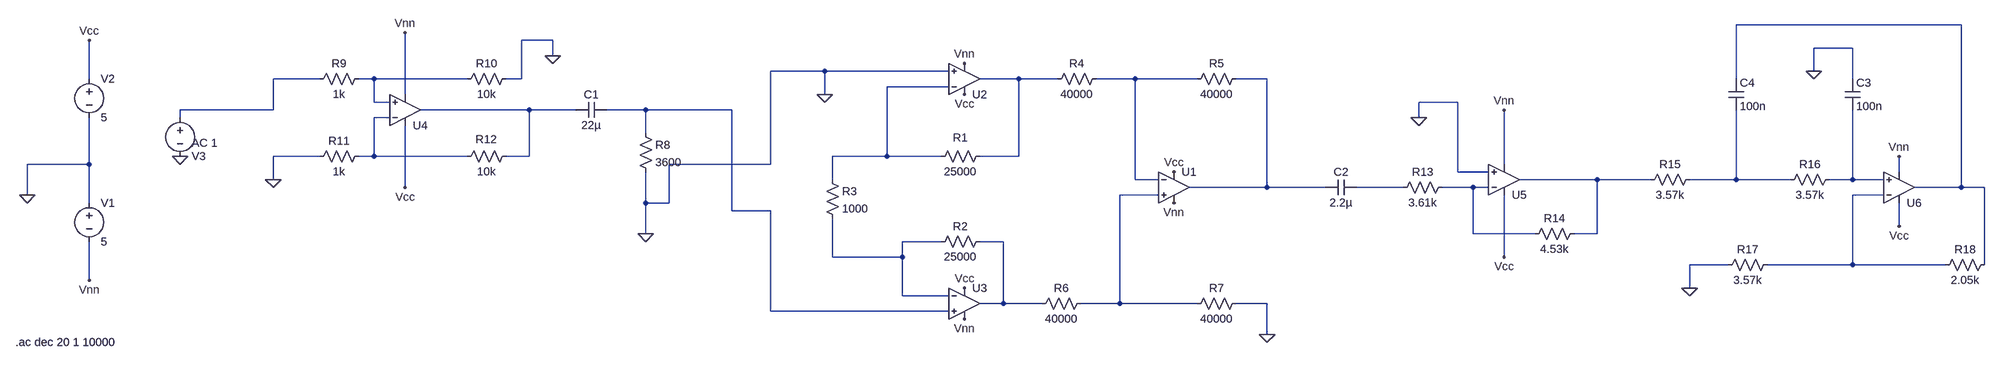
[diagram p0: schematic SimulationCircuit.asc]
SimulationCircuit.asc, the LTspice schematic file:
Version 4
SHEET 1 3172 680
WIRE 3040 -64 2576 -64
WIRE -144 -32 -208 -32
WIRE 2816 -16 2736 -16
WIRE -144 0 -144 -32
WIRE 432 32 320 32
WIRE 688 32 432 32
WIRE 2736 32 2736 -16
WIRE -1136 48 -1136 -32
WIRE -624 48 -720 48
WIRE -512 48 -544 48
WIRE -320 48 -512 48
WIRE -208 48 -208 -32
WIRE -208 48 -240 48
WIRE 832 48 752 48
WIRE 912 48 832 48
WIRE 1072 48 992 48
WIRE 1200 48 1072 48
WIRE 1344 48 1280 48
WIRE 2576 48 2576 -64
WIRE 2816 48 2816 -16
WIRE 688 64 560 64
WIRE -448 80 -448 -48
WIRE 432 80 432 32
WIRE -512 96 -512 48
WIRE -480 96 -512 96
WIRE 1840 96 1760 96
WIRE -720 112 -720 48
WIRE -720 112 -912 112
WIRE -192 112 -416 112
WIRE -96 112 -192 112
WIRE 48 112 -32 112
WIRE 240 112 48 112
WIRE -912 128 -912 112
WIRE -480 128 -512 128
WIRE 1760 128 1760 96
WIRE 48 160 48 112
WIRE -624 208 -720 208
WIRE -512 208 -512 128
WIRE -512 208 -544 208
WIRE -320 208 -512 208
WIRE -192 208 -192 112
WIRE -192 208 -240 208
WIRE 560 208 560 64
WIRE 560 208 448 208
WIRE 672 208 560 208
WIRE 832 208 832 48
WIRE 832 208 752 208
WIRE -1136 224 -1136 128
WIRE -1136 224 -1264 224
WIRE 320 224 320 32
WIRE 320 224 96 224
WIRE 1936 224 1936 112
WIRE 1840 240 1840 96
WIRE 1904 240 1840 240
WIRE 2912 240 2912 208
WIRE -720 256 -720 208
WIRE 448 256 448 208
WIRE 1072 256 1072 48
WIRE 1120 256 1072 256
WIRE 2128 256 1968 256
WIRE 2400 256 2128 256
WIRE 2576 256 2576 112
WIRE 2576 256 2480 256
WIRE 2688 256 2576 256
WIRE 2816 256 2816 112
WIRE 2816 256 2768 256
WIRE 2880 256 2816 256
WIRE -448 272 -448 144
WIRE 1344 272 1344 48
WIRE 1344 272 1184 272
WIRE 1568 272 1344 272
WIRE 1728 272 1632 272
WIRE 1872 272 1808 272
WIRE 1904 272 1872 272
WIRE 3040 272 3040 -64
WIRE 3040 272 2944 272
WIRE 3088 272 3040 272
WIRE -1264 288 -1264 224
WIRE 1120 288 1040 288
WIRE 2880 288 2816 288
WIRE -1136 304 -1136 224
WIRE 48 304 48 240
WIRE 96 304 96 224
WIRE 96 304 48 304
WIRE 240 320 240 112
WIRE 320 320 240 320
WIRE 2912 352 2912 304
WIRE 48 368 48 304
WIRE 1872 368 1872 272
WIRE 2000 368 1872 368
WIRE 2128 368 2128 256
WIRE 2128 368 2080 368
WIRE 672 384 592 384
WIRE 800 384 752 384
WIRE 448 416 448 336
WIRE 592 416 592 384
WIRE 592 416 448 416
WIRE 1936 416 1936 288
WIRE 2560 432 2480 432
WIRE 2816 432 2816 288
WIRE 2816 432 2640 432
WIRE 3008 432 2816 432
WIRE 3088 432 3088 272
WIRE -1136 464 -1136 384
WIRE 2480 480 2480 432
WIRE 592 496 592 416
WIRE 688 496 592 496
WIRE 800 512 800 384
WIRE 800 512 752 512
WIRE 880 512 800 512
WIRE 1040 512 1040 288
WIRE 1040 512 960 512
WIRE 1200 512 1040 512
WIRE 1344 512 1280 512
WIRE 320 528 320 320
WIRE 688 528 320 528
WIRE 1344 576 1344 512
FLAG -1264 288 0
FLAG -1136 -32 Vcc
FLAG -1136 464 Vnn
FLAG 1344 576 0
FLAG 720 480 Vcc
FLAG 1152 240 Vcc
FLAG 720 80 Vcc
FLAG 720 16 Vnn
FLAG 720 544 Vnn
FLAG 1152 304 Vnn
FLAG 432 80 0
FLAG 48 368 0
FLAG -912 208 0
FLAG -720 256 0
FLAG -144 0 0
FLAG -448 -48 Vnn
FLAG -448 272 Vcc
FLAG 1760 128 0
FLAG 1936 112 Vnn
FLAG 1936 416 Vcc
FLAG 2736 32 0
FLAG 2480 480 0
FLAG 2912 208 Vnn
FLAG 2912 352 Vcc
SYMBOL voltage -1136 288 R0
WINDOW 123 0 0 Left 0
WINDOW 39 0 0 Left 0
SYMATTR InstName V1
SYMATTR Value 5
SYMBOL voltage -1136 32 R0
WINDOW 123 0 0 Left 0
WINDOW 39 0 0 Left 0
SYMATTR InstName V2
SYMATTR Value 5
SYMBOL res 768 192 R90
WINDOW 0 -7 56 VBottom 2
WINDOW 3 32 56 VTop 2
SYMATTR InstName R1
SYMATTR Value 25000
SYMBOL res 768 368 R90
WINDOW 0 0 56 VBottom 2
WINDOW 3 32 56 VTop 2
SYMATTR InstName R2
SYMATTR Value 25000
SYMBOL res 432 240 R0
SYMATTR InstName R3
SYMATTR Value 1000
SYMBOL res 1008 32 R90
WINDOW 0 0 56 VBottom 2
WINDOW 3 32 56 VTop 2
SYMATTR InstName R4
SYMATTR Value 40000
SYMBOL res 1296 32 R90
WINDOW 0 0 56 VBottom 2
WINDOW 3 32 56 VTop 2
SYMATTR InstName R5
SYMATTR Value 40000
SYMBOL res 976 496 R90
WINDOW 0 0 56 VBottom 2
WINDOW 3 32 56 VTop 2
SYMATTR InstName R6
SYMATTR Value 40000
SYMBOL res 1296 496 R90
WINDOW 0 0 56 VBottom 2
WINDOW 3 32 56 VTop 2
SYMATTR InstName R7
SYMATTR Value 40000
SYMBOL Opamps\\UniversalOpamp2 1152 272 R0
SYMATTR InstName U1
SYMBOL Opamps\\UniversalOpamp2 720 48 M180
SYMATTR InstName U2
SYMBOL Opamps\\UniversalOpamp2 720 512 R0
SYMATTR InstName U3
SYMBOL voltage -912 112 R0
WINDOW 0 24 96 Left 2
WINDOW 3 24 16 Left 2
WINDOW 123 24 68 Left 2
WINDOW 39 0 0 Left 0
SYMATTR InstName V3
SYMATTR Value ""
SYMATTR Value2 AC 1
SYMBOL res 32 144 R0
SYMATTR InstName R8
SYMATTR Value 3600
SYMBOL cap -32 96 R90
WINDOW 0 0 32 VBottom 2
WINDOW 3 32 32 VTop 2
SYMATTR InstName C1
SYMATTR Value 22µ
SYMBOL Opamps\\UniversalOpamp2 -448 112 M180
SYMATTR InstName U4
SYMBOL res -528 32 R90
WINDOW 0 0 56 VBottom 2
WINDOW 3 32 56 VTop 2
SYMATTR InstName R9
SYMATTR Value 1k
SYMBOL res -224 32 R90
WINDOW 0 0 56 VBottom 2
WINDOW 3 32 56 VTop 2
SYMATTR InstName R10
SYMATTR Value 10k
SYMBOL res -528 192 R90
WINDOW 0 0 56 VBottom 2
WINDOW 3 32 56 VTop 2
SYMATTR InstName R11
SYMATTR Value 1k
SYMBOL res -224 192 R90
WINDOW 0 -4 57 VBottom 2
WINDOW 3 32 56 VTop 2
SYMATTR InstName R12
SYMATTR Value 10k
SYMBOL cap 1632 256 R90
WINDOW 0 0 32 VBottom 2
WINDOW 3 32 32 VTop 2
SYMATTR InstName C2
SYMATTR Value 2.2µ
SYMBOL res 1824 256 R90
WINDOW 0 0 56 VBottom 2
WINDOW 3 32 56 VTop 2
SYMATTR InstName R13
SYMATTR Value 3.61k
SYMBOL res 2096 352 R90
WINDOW 0 0 56 VBottom 2
WINDOW 3 32 56 VTop 2
SYMATTR InstName R14
SYMATTR Value 4.53k
SYMBOL Opamps\\UniversalOpamp2 1936 256 M180
SYMATTR InstName U5
SYMBOL res 2496 240 R90
WINDOW 0 0 56 VBottom 2
WINDOW 3 32 56 VTop 2
SYMATTR InstName R15
SYMATTR Value 3.57k
SYMBOL res 2784 240 R90
WINDOW 0 0 56 VBottom 2
WINDOW 3 32 56 VTop 2
SYMATTR InstName R16
SYMATTR Value 3.57k
SYMBOL res 2656 416 R90
WINDOW 0 0 56 VBottom 2
WINDOW 3 32 56 VTop 2
SYMATTR InstName R17
SYMATTR Value 3.57k
SYMBOL Opamps\\UniversalOpamp2 2912 272 M180
SYMATTR InstName U6
SYMBOL cap 2800 48 R0
SYMATTR InstName C3
SYMATTR Value 100n
SYMBOL cap 2560 48 R0
SYMATTR InstName C4
SYMATTR Value 100n
SYMBOL res 3104 416 R90
WINDOW 0 0 56 VBottom 2
WINDOW 3 32 56 VTop 2
SYMATTR InstName R18
SYMATTR Value 2.05k
TEXT -1288 592 Left 2 !.ac dec 20 1 10000

The netlist it stands for:
* SimulationCircuit.asc
V1 0 Vnn 5
V2 Vcc 0 5
R1 N004 N007 25000
R2 N019 N018 25000
R3 N007 N018 1000
R4 N005 N004 40000
R5 N006 N005 40000
R6 N016 N019 40000
R7 0 N016 40000
XU1 N016 N005 Vcc Vnn N006 level.2 Avol=1Meg GBW=10Meg Slew=10Meg ilimit=25m rail=0 Vos=0 phimargin=45 en=0 enk=0 in=0 ink=0 Rin=500Meg  ; pins IN+ IN- V+ V- OUT
XU2 0 N007 Vcc Vnn N004 level.2 Avol=1Meg GBW=10Meg Slew=10Meg ilimit=25m rail=0 Vos=0 phimargin=45 en=0 enk=0 in=0 ink=0 Rin=500Meg  ; pins IN+ IN- V+ V- OUT
XU3 N009 N018 Vcc Vnn N019 level.2 Avol=1Meg GBW=10Meg Slew=10Meg ilimit=25m rail=0 Vos=0 phimargin=45 en=0 enk=0 in=0 ink=0 Rin=500Meg  ; pins IN+ IN- V+ V- OUT
V3 N002 0 AC 1
R8 N009 0 3600
C1 N009 N008 22µ
XU4 N003 N010 Vcc Vnn N008 level.2 Avol=1Meg GBW=10Meg Slew=10Meg ilimit=25m rail=0 Vos=0 phimargin=45 en=0 enk=0 in=0 ink=0 Rin=500Meg  ; pins IN+ IN- V+ V- OUT
R9 N003 N002 1k
R10 0 N003 10k
R11 N010 0 1k
R12 N008 N010 10k
C2 N014 N006 2.2µ
R13 N015 N014 3.61k
R14 N011 N015 4.53k
XU5 0 N015 Vcc Vnn N011 level.2 Avol=1Meg GBW=10Meg Slew=10Meg ilimit=25m rail=0 Vos=0 phimargin=45 en=0 enk=0 in=0 ink=0 Rin=500Meg  ; pins IN+ IN- V+ V- OUT
R15 N012 N011 3.57k
R16 N013 N012 3.57k
R17 N017 0 3.57k
XU6 N013 N017 Vcc Vnn N001 level.2 Avol=1Meg GBW=10Meg Slew=10Meg ilimit=25m rail=0 Vos=0 phimargin=45 en=0 enk=0 in=0 ink=0 Rin=500Meg  ; pins IN+ IN- V+ V- OUT
C3 0 N013 100n
C4 N001 N012 100n
R18 N001 N017 2.05k
.ac dec 20 1 10000
.lib UniversalOpamps2.sub
.backanno
.end